# EasyEDA Pro project Armor_ProProject.epro, board PCB9
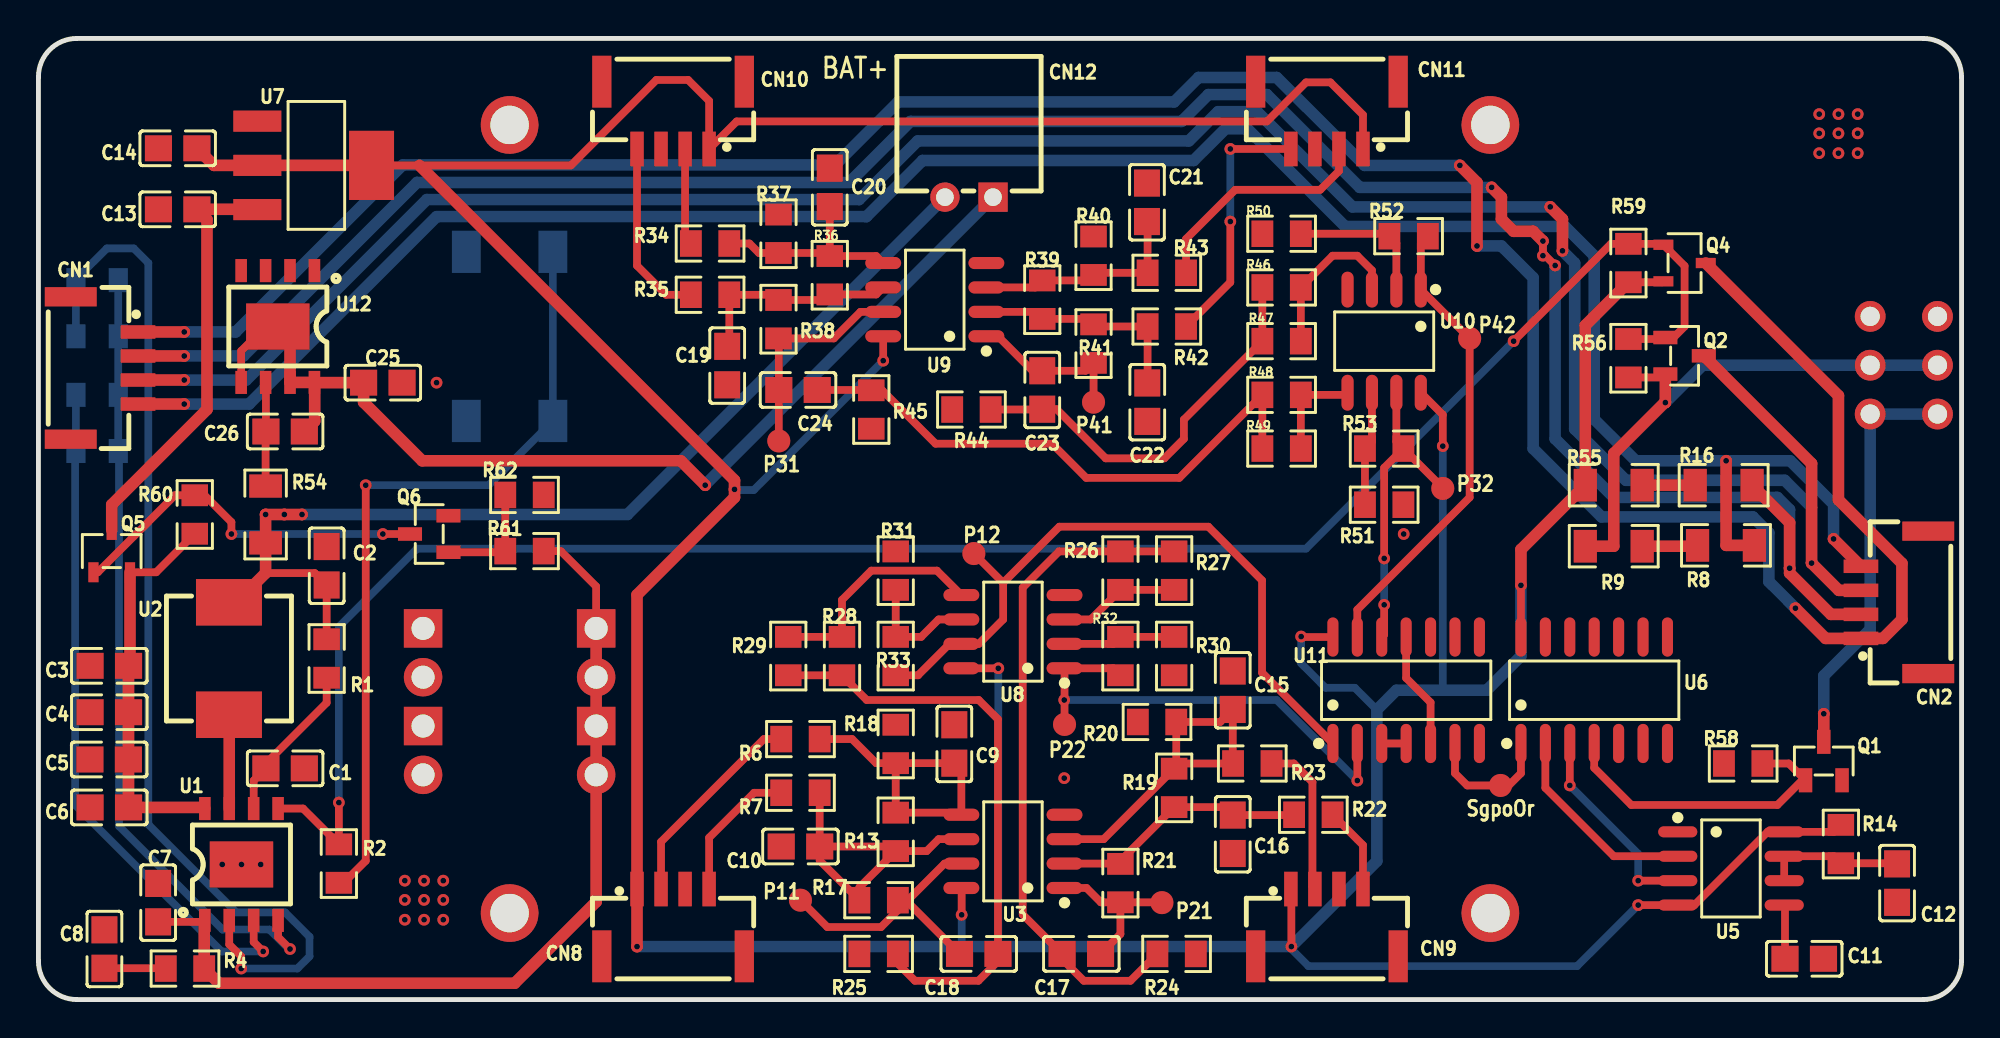
[diagram p10: board, top side]
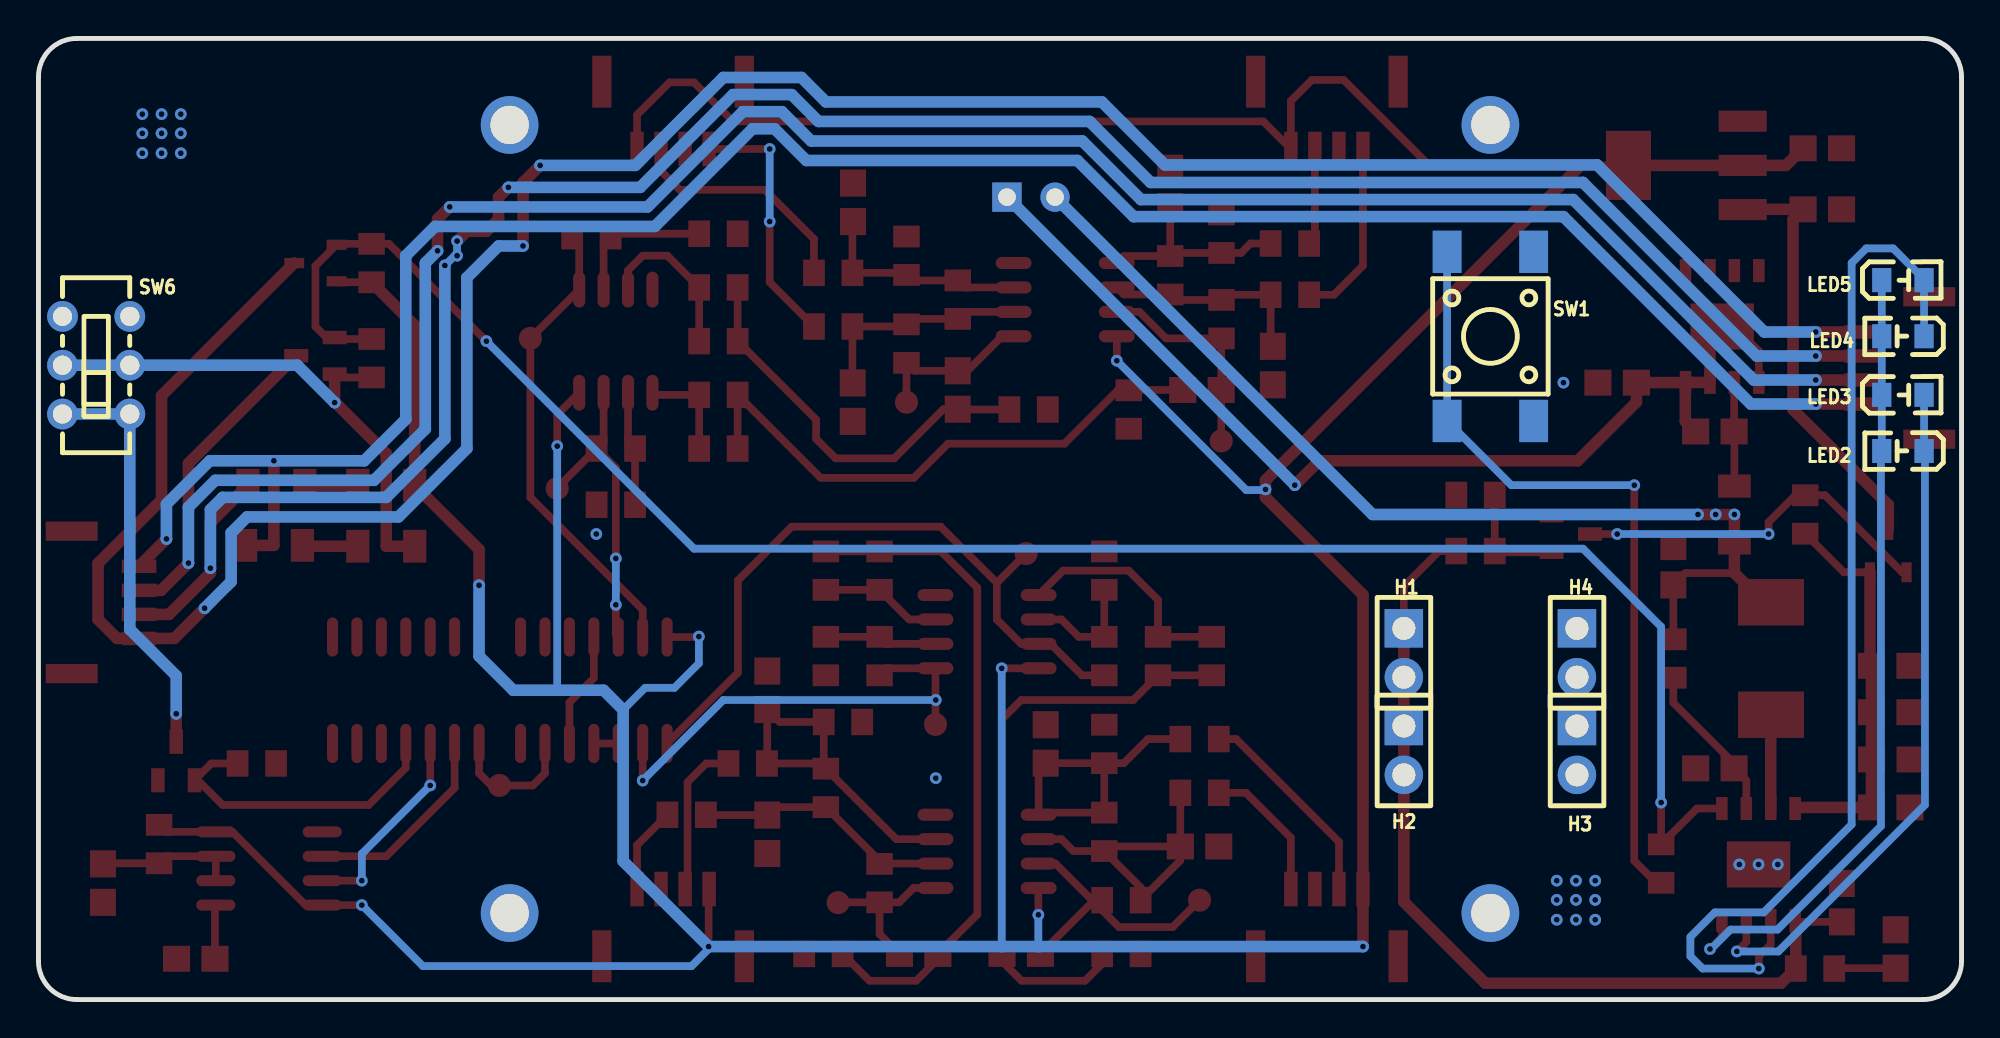
[diagram p11: board, bottom side, seen from below]

Outline 100 x 50 mm; copper layers: Top Layer, Bottom Layer. Coordinates in mm from the lower left corner of the outline.
Outline path: 0,48 0,2 arc(0.59,0.59) 2,0 98,0 arc(99.41,0.59) 100,2 100,48 arc(99.41,49.41) 98,50 2,50 arc(0.59,49.41) 0,48
Stack: Top Layer 0.035mm / Dielectric1 1.51mm FR4 er 4.5 / Bottom Layer 0.035mm

## Design rules (mm)
template: JLCPCB Capability(Two Layers Board)
spacing copperThickness1oz (default): track to track 0.102, other pairs 0.152 to 0.3
spacing copperThickness2oz: track to track 0.203, other pairs 0.152 to 0.3
track width copperThickness1oz (default): min 0.127, default 0.254, max 2.54
track width copperThickness2oz: min 0.203, default 0.254, max 2.54
differential pair differentialPair (default): width min 0.127, default 0.254, max 2.54; gap min 0.152, default 0.152
via viaSize (default): diameter min 0.5, default 0.61, max 10; hole min 0.3, default 0.305, max 6.3

## Placement (name value [footprint] x y rotation side)
C1  22uF  [C0805]  12.83 12.03 180 top
C2  22uF  [C0805]  14.99 22.57 270 top
C3  22uF  [C0805]  3.68 17.36 0 top
C4  22uF  [C0805]  3.68 14.95 0 top
C5  22uF  [C0805]  3.68 12.49 0 top
C6  22uF  [C0805]  3.68 10 0 top
C7  10uF  [C0805]  6.22 5.04 90 top
C8  10uF  [C0805]  3.43 2.63 90 top
C9  100nF  [C0805]  47.62 13.3 270 top
C10  100nF  [C0805]  39.62 7.96 180 top
C11  10nF  [C0805]  91.82 2.12 180 top
C12  10uF  [C0805]  96.65 6.06 90 top
C13  10uF  [C0805]  7.24 41.11 0 top
C14  10uF  [C0805]  7.24 44.28 180 top
C15  100nF  [C0805]  62.1 16.09 270 top
C16  100nF  [C0805]  62.1 8.6 270 top
C17  100uF  [C0805]  54.23 2.38 180 top
C18  100uF  [C0805]  48.9 2.38 0 top
C19  100nF  [C0805]  35.81 32.98 270 top
C20  100nF  [C0805]  41.15 42.25 270 top
C21  100nF  [C0805]  57.64 41.47 270 top
C22  100nF  [C0805]  57.66 31.08 270 top
C23  100uF  [C0805]  52.2 31.71 270 top
C24  100uF  [C0805]  39.5 31.71 0 top
C25  2.2uF  [C0805]  17.91 32.09 0 top
C26  4.7uF  [C0805]  12.83 29.55 180 top
CN1  LED2  [CONN-SMD_4P-P1.27_GH125-S04DCA-00]  3.43 32.86 270 top
CN2  LED1  [CONN-SMD_4P-P1.27_GH125-S04DCA-00]  96.52 20.66 90 top
CN8  应变片1  [CONN-SMD_4P-P1.27_GH125-S04DCA-00]  33 4 0 top
CN9  应变片2  [CONN-SMD_4P-P1.27_GH125-S04DCA-00]  67 4 0 top
CN10  应变片3  [CONN-SMD_4P-P1.27_GH125-S04DCA-00]  33 46 180 top
CN11  应变片4  [CONN-SMD_4P-P1.27_GH125-S04DCA-00]  67 46 180 top
CN12  电池  [CONN-TH_2P-P2.50_HDGC2501WR-2P]  48.39 41.75 180 top
H1  -  [HDR-TH_2P-P2.54-V-F]  29 18.04 270 bottom
H2  -  [HDR-TH_2P-P2.54-V-F]  29 12.96 270 bottom
H3  -  [HDR-TH_2P-P2.54-V-F]  20 12.96 270 bottom
H4  -  [HDR-TH_2P-P2.54-V-F]  20 18.04 270 bottom
LED2  D4  [LED0805-RD]  3.05 28.54 0 bottom
LED3  D3  [LED0805-RD]  3.05 31.46 180 bottom
LED4  D2  [LED0805-RD]  3.05 34.51 0 bottom
LED5  D1  [LED0805-RD]  3.05 37.43 180 bottom
NOREF  -  [Pad_e2305]  53.36 14.31 0 top
NOREF#2  -  [Pad_e258]  75.5 4.5 0 top
NOREF#3  -  [Pad_e2300]  39.62 5.17 0 top
NOREF#4  -  [Pad_e2293]  58.42 5.04 0 top
NOREF#5  -  [Pad_e259]  75.5 45.5 0 top
NOREF#6  -  [Pad_e257]  24.5 4.5 0 top
NOREF#7  -  [Pad_e256]  24.5 45.5 0 top
NOREF#8  -  [Pad_e24]  76.03 11.14 0 top
NOREF#9  -  [Pad_e13]  54.86 31.08 0 top
NOREF#10  -  [Pad_e8]  38.5 29.06 0 top
NOREF#11  -  [Pad_e3]  48.64 23.2 0 top
NOREF#12  -  [Pad_e15]  74.42 34.39 0 top
NOREF#13  -  [Pad_e20]  73.03 26.59 0 top
Q1  NMOS  [SOT-23-3_L2.9-W1.3-P1.90-LS2.4-BR]  92.84 12.41 270 top
Q2  NMOS  [SOT-23-3_L2.9-W1.3-P1.90-LS2.4-BR]  85.6 33.49 180 top
Q4  PMOS  [SOT-23-3_L3.0-W1.7-P0.95-LS2.9-BR]  85.6 38.32 180 top
Q5  PMOS  [SOT-23-3_L3.0-W1.7-P0.95-LS2.9-BR]  3.81 23.33 270 top
Q6  NPN  [SOT-23-3_L2.9-W1.3-P1.90-LS2.4-BR]  20.32 24.22 0 top
R1  500mΩ  [R0805]  14.99 17.74 90 top
R2  10kΩ  [R0805]  15.62 7.07 90 top
R4  2Ω  [R0805]  7.62 1.61 180 top
R6  1kΩ  [R0805]  39.62 13.55 180 top
R7  1kΩ  [R0805]  39.62 10.76 0 top
R8  2Ω  [R1206]  87.75 23.63 0 top
R9  1Ω  [R1206]  81.91 23.58 0 top
R13  10kΩ  [R0805]  44.58 8.72 270 top
R14  5.1kΩ  [R0805]  93.73 8.09 270 top
R16  150mΩ  [R1206]  87.63 26.76 0 top
R17  50kΩ  [R0805]  43.69 5.17 0 top
R18  50kΩ  [R0805]  44.58 13.3 90 top
R19  10kΩ  [R0805]  59.06 11.01 270 top
R20  50kΩ  [R0805]  58.17 14.44 180 top
R21  50kΩ  [R0805]  56.26 6.06 270 top
R22  1kΩ  [R0805]  66.29 9.61 180 top
R23  1kΩ  [R0805]  63.12 12.28 180 top
R24  1kΩ  [R0805]  59.18 2.38 0 top
R25  1kΩ  [R0805]  43.69 2.38 180 top
R26  1kΩ  [R0805]  56.26 22.31 270 top
R27  100kΩ  [R0805]  59.06 22.31 270 top
R28  1kΩ  [R0805]  41.78 17.87 90 top
R29  100kΩ  [R0805]  38.99 17.87 90 top
R30  1kΩ  [R0805]  59.06 17.87 90 top
R31  1kΩ  [R0805]  44.58 22.31 270 top
R32  100kΩ  [R0805]  56.26 17.87 270 top
R33  100kΩ  [R0805]  44.58 17.87 270 top
R34  1kΩ  [R0805]  34.93 39.33 180 top
R35  1kΩ  [R0805]  34.93 36.67 0 top
R36  10kΩ  [R0805]  41.15 37.68 270 top
R37  50kΩ  [R0805]  38.48 39.84 90 top
R38  50kΩ  [R0805]  38.48 35.39 270 top
R39  10kΩ  [R0805]  52.2 36.41 270 top
R40  50kΩ  [R0805]  54.86 38.7 90 top
R41  50kΩ  [R0805]  54.86 34.12 270 top
R42  1kΩ  [R0805]  58.67 35.01 180 top
R43  1kΩ  [R0805]  58.67 37.81 180 top
R44  1kΩ  [R0805]  48.51 30.7 180 top
R45  1kΩ  [R0805]  43.31 30.7 270 top
R46  1kΩ  [R0805]  64.64 37.05 0 top
R47  100kΩ  [R0805]  64.64 34.25 0 top
R48  1kΩ  [R0805]  64.64 31.46 0 top
R49  100kΩ  [R0805]  64.64 28.66 0 top
R50  1kΩ  [R0805]  64.64 39.84 0 top
R51  1kΩ  [R0805]  69.98 25.74 180 top
R52  100kΩ  [R0805]  71.25 39.71 0 top
R53  100kΩ  [R0805]  69.98 28.66 0 top
R54  100Ω  [R1206]  11.81 25.23 270 top
R55  1.5Ω  [R1206]  81.91 26.76 0 top
R56  10kΩ  [R0805]  82.68 33.36 90 top
R58  10kΩ  [R0805]  88.65 12.28 0 top
R59  10kΩ  [R0805]  82.68 38.32 90 top
R60  10kΩ  [R0805]  8.13 25.23 90 top
R61  1kΩ  [R0805]  25.27 23.33 0 top
R62  10kΩ  [R0805]  25.27 26.25 0 top
SW1  KH-6X6X4.3H-STM  [SW-SMD_4P-L6.0-W6.0-P4.50-LS9.0]  24.5 34.5 270 bottom
SW6  Bling SW  [SW-TH_MSS22D18GX]  97 33 270 bottom
U1  充电宝  [ESOP-8_L4.9-W3.9-P1.27-LS6.0-BL-EP]  10.56 7.03 0 top
U2  1uH  [IND-SMD_L6.5-W6.5_IHLP-2525]  9.91 17.74 90 top
U3  LM358  [SOP-8_L4.9-W3.9-P1.27-LS6.0-BL]  50.67 7.71 90 top
U5  小于Vcc/3触发 输出高电平  [SOP-8_L5.0-W4.0-P1.27-LS6.0-BL]  88.01 6.82 270 top
U6  非门  [SOIC-14_L8.7-W3.9-P1.27-LS6.0-BL]  80.9 16.09 0 top
U7  NCP1117ST33T3G  [SOT-223-3_L6.5-W3.4-P2.30-LS7.0-BR]  14.35 43.4 180 top
U8  LM358  [SOP-8_L4.9-W3.9-P1.27-LS6.0-BL]  50.67 19.14 90 top
U9  LM358  [SOP-8_L4.9-W3.9-P1.27-LS6.0-BL]  46.61 36.41 90 top
U10  LM358  [SOP-8_L4.9-W3.9-P1.27-LS6.0-BL]  69.98 34.25 180 top
U11  或门  [SOIC-14_L8.7-W3.9-P1.27-LS6.0-BL]  71.12 16.09 0 top
U12  IP3005A  [ESOP-8_L4.9-W3.9-P1.27-LS6.0-BL-EP]  12.45 35.01 180 top

## Footprints (pads in the part's own frame, mm; a bottom-side part is the same pattern mirrored in y, then rotated)
C0805
  rect 1.41x1.35 smd: 1(-1,0) 2(1,0)
CONN-SMD_4P-P1.27_GH125-S04DCA-00
  rect 0.7x1.8 smd: 1(-1.875,1.75) 2(-0.625,1.75) 3(0.625,1.75) 4(1.875,1.75)
  rect 1x2.7 smd: 5(3.705,-1.75) 6(-3.705,-1.75)
CONN-TH_2P-P2.50_HDGC2501WR-2P
  rect 1.524x1.524 hole 0.914: 1(-1.25,0)
  round 1.524 hole 0.914: 2(1.25,0)
ESOP-8_L4.9-W3.9-P1.27-LS6.0-BL-EP
  rect 0.6x1.2 smd: 1(-1.905,-2.909) 2(-0.635,-2.909) 3(0.635,-2.909) 4(1.905,-2.909) 5(1.905,2.909) 6(0.635,2.909) 7(-0.635,2.909) 8(-1.905,2.909)
  rect 3.3x2.4 smd: 9(0,0)
HDR-TH_2P-P2.54-V-F
  rect 2x2 hole 1.2: 1(-1.27,0)
  round 2 hole 1.2: 2(1.27,0)
IND-SMD_L6.5-W6.5_IHLP-2525
  rect 2.42x3.43 smd: 1(-2.925,0) 2(2.925,0)
LED0805-RD
  rect 1x1.25 smd: 1(-1.1,0) 2(1.1,0)
Pad_e3
  round 1.2 smd: P12(0,0)
Pad_e8
  round 1.2 smd: P31(0,0)
Pad_e13
  round 1.2 smd: P41(0,0)
Pad_e15
  round 1.2 smd: P42(0,0)
Pad_e20
  round 1.2 smd: P32(0,0)
Pad_e24
  round 1.2 smd: SgpoOr(0,0)
Pad_e256
  round 3 hole 2: 1(0,0)
Pad_e257
  round 3 hole 2: 1(0,0)
Pad_e258
  round 3 hole 2: 1(0,0)
Pad_e259
  round 3 hole 2: 1(0,0)
Pad_e2293
  round 1.2 smd: P21(0,0)
Pad_e2300
  round 1.2 smd: P11(0,0)
Pad_e2305
  round 1.2 smd: P22(0,0)
R0805
  rect 1.133x1.377 smd: 1(-1,0) 2(1,0)
R1206
  rect 1.208x1.701 smd: 1(-1.479,0) 2(1.479,0)
SOIC-14_L8.7-W3.9-P1.27-LS6.0-BL
  oval 0.574x2.038 smd: 1(-3.81,-2.769) 2(-2.54,-2.769) 3(-1.27,-2.769) 4(0,-2.769) 5(1.27,-2.769) 6(2.54,-2.769) 7(3.81,-2.769) 8(3.81,2.769) 9(2.54,2.769) 10(1.27,2.769) 11(0,2.769) 12(-1.27,2.769) 13(-2.54,2.769) 14(-3.81,2.769)
SOP-8_L4.9-W3.9-P1.27-LS6.0-BL
  oval 0.63x1.865 smd: 1(-1.905,-2.683) 2(-0.635,-2.683) 3(0.635,-2.683) 4(1.905,-2.683) 5(1.905,2.683) 6(0.635,2.683) 7(-0.635,2.683) 8(-1.905,2.683)
SOP-8_L5.0-W4.0-P1.27-LS6.0-BL
  oval 0.574x2.035 smd: 1(-1.905,-2.768) 2(-0.635,-2.768) 3(0.635,-2.768) 4(1.905,-2.768) 5(1.905,2.768) 6(0.635,2.768) 7(-0.635,2.768) 8(-1.905,2.768)
SOT-23-3_L2.9-W1.3-P1.90-LS2.4-BR
  rect 1.25x0.7 smd: 1(1,-0.95) 2(1,0.95) 3(-1,0)
SOT-23-3_L3.0-W1.7-P0.95-LS2.9-BR
  rect 1.038x0.532 smd: 1(1.101,-0.95) 2(1.101,0.95) 3(-1.101,0)
SOT-223-3_L6.5-W3.4-P2.30-LS7.0-BR
  rect 2.5x1.1 smd: 1(2.97,-2.3) 2(2.97,0) 3(2.97,2.3)
  rect 2.34x3.6 smd: 4(-2.97,0)
SW-SMD_4P-L6.0-W6.0-P4.50-LS9.0
  rect 2.2x1.5 smd: 1(-4.4,2.25) 2(-4.4,-2.25) 3(4.4,2.25) 4(4.4,-2.25)
SW-TH_MSS22D18GX
  round 1.6 hole 1: 1(-2.54,1.75) 2(0,1.75) 3(2.54,1.75) 4(-2.54,-1.75) 5(0,-1.75) 6(2.54,-1.75)

## Nets
As in the schematic, except:
SGPO1: NOREF#11.P12 R33.2 U8.7 U11.1
SGPO2: NOREF.P22 R32.2 U8.1 U11.2
SGPO3: NOREF#13.P32 R53.2 U10.7 U11.12
SGPO4: NOREF#12.P42 R52.2 U10.1 U11.13
SGPO-OR: NOREF#8.SgpoOr U6.1 U11.6
$1N1799: C18.1 NOREF#3.P11 R17.2 U3.7
$1N9328: C17.1 NOREF#4.P21 R21.2 U3.1
$1N12385: C24.1 NOREF#10.P31 R38.2 U9.7
$1N12421: C23.1 NOREF#9.P41 R41.2 U9.1

Pads without a net: CN1 5 6; CN2 5 6; CN8 5 6; CN9 5 6; CN10 5 6; CN11 5 6; NOREF#2 1; NOREF#5 1; NOREF#6 1; NOREF#7 1; U6 5 6 8 9 10 11 12 13; U11 8 9 10; U12 1

## Via types
v1: diameter 0.61, hole 0.305, Top Layer to Bottom Layer, 73 vias

## Routing (per net, layer and track width the routed paths; a pad name or vN(x,y) marks a point on that pad's centre or on a via; arc(x,y) is an arc through that point)
3V3: length 292.7
  Top Layer w0.4: v1(65.15,2.76) 65.15,5.72 CN9.1 ; U7.4 27.69,43.4 32.13,47.84 33.78,47.84 34.88,46.75 CN10.1 36.31,45.68 63.88,45.68 65.91,47.71 67.18,47.71 68.88,46.02 CN11.1 ; v1(83.19,4.92) 86.11,4.92 89.92,8.72 U5.8 93.36,8.72 R14.1 ; U3.8 48.01,5.79 v1(48.01,4.41) ; U9.8 v1(43.93,33.24) ; v1(65.66,18.89) 65.68,18.86 U11.14 ; v1(73.03,28.79) 73.03,30.43 U10.8 ; U8.8 v1(49.91,17.23) ; Q4.2 84.45,37.32 R59.1 ; U6.14 v1(77.09,21.55)
  Top Layer w0.6: R59.1 80.44,35.08 R55.1 77.09,23.41 v1(77.09,21.55) ; U7.4 U7.2 9.13,43.4 C14.1 ; 19.81,43.4 36.19,27.01 v1(36.19,26.54) 36.19,26.12 31.12,21.05 CN8.1 v1(31.12,2.76)
  Bottom Layer w0.4: 49.9,2.76 49.91,2.76 v1(49.91,17.23) ; 69.6,15.08 68.45,16.22 66.93,16.22 65.66,17.49 v1(65.66,18.89) ; 48.01,2.76 v1(48.01,4.41) ; v1(73.03,28.79) 73.03,16.14 72.97,16.09 ; v1(65.15,2.76) 65.15,2.63 66.04,1.74 80.01,1.74 v1(83.19,4.92) ; 36.19,26.5 37.2,26.5 v1(43.93,33.24)
  Bottom Layer w0.6: v1(77.09,21.55) 77.09,17.87 75.31,16.09 70.61,16.09 69.6,15.08 69.6,7.2 v1(65.15,2.76) v1(31.12,2.76)
GND:
  vias: v1(9.56,7.03) v1(10.56,7.03) v1(11.56,7.03) v1(19.05,6.19) v1(19.05,5.19) v1(19.05,4.15) v1(20.05,6.19) v1(20.05,5.19) v1(20.05,4.15) v1(20.7,32.09) v1(21.05,6.19) v1(21.05,5.19) v1(21.05,4.15) v1(53.34,11.52) v1(70.99,24.22) v1(92.6,46.06) v1(92.6,45.06) v1(92.6,44.03) v1(93.6,46.06) v1(93.6,45.06) v1(93.6,44.03) v1(94.6,46.06) v1(94.6,45.06) v1(94.6,44.03)
1GRAY: length 7.4
  Top Layer w0.4: CN8.4 34.88,8.42 37.21,10.76 R7.1
1WHITE: length 10.9
  Top Layer w0.4: CN8.2 32.38,8.21 37.72,13.55 R6.2
555OUT: length 10.7
  Top Layer w0.4: U5.3 v1(83.19,6.19) ; v1(79.63,11.14) U6.3
  Bottom Layer w0.4: v1(83.19,6.19) 83.19,7.58 v1(79.63,11.14)
555OUTNO: length 16.2
  Top Layer w0.4: U6.4 80.9,12.05 82.83,10.12 90.42,10.12 91.71,11.41 Q1.1 91.01,12.28 R58.2
B+: length 121.4
  Top Layer w0.4: v1(78.23,39.46) v1(78.23,38.7) 78.36,38.7 v1(78.87,38.19)
  Top Layer w0.6: R16.2 91.06,24.81 v1(91.06,22.44) 91.06,22.19 93.21,20.04 CN2.2 ; v1(7.58,33.48) CN1.2 ; v1(78.23,39.46) 77.72,39.97 76.71,39.97 76.07,40.6 76.07,41.75 v1(75.56,42.25)
  Bottom Layer w0.4: v1(78.23,39.46) 78.23,38.82 v1(78.87,38.19)
  Bottom Layer w0.6: v1(91.06,22.44) 91.06,25.49 90.42,26.12 81.91,26.12 78.87,29.17 v1(78.87,38.19) ; v1(75.56,42.25) 68.71,42.25 63.88,47.08 60.83,47.08 59.44,45.68 45.34,45.68 42.16,42.51 19.69,42.51 10.66,33.48 v1(7.58,33.48)
B-: length 126.5
  Top Layer w0.6: CN2.3 93.62,21.29 v1(92.2,22.71) 92.2,27.89 Q2.3 ; v1(79.25,38.95) 79.25,40.6 v1(78.61,41.24) ; v1(7.58,32.23) CN1.3
  Bottom Layer w0.6: v1(92.2,22.71) 92.2,25.62 90.81,27.01 82.55,27.01 79.88,29.68 79.88,38.32 v1(79.25,38.95) ; v1(78.61,41.24) 68.33,41.24 63.37,46.19 61.34,46.19 59.82,44.67 45.72,44.67 42.67,41.62 20.19,41.62 10.81,32.23 v1(7.58,32.23)
BAT+: length 54
  Top Layer w0.4: R1.2 C2.2 14.37,22.19 11.81,22.19
  Top Layer w0.6: U2.2 10.29,20.67 11.81,22.19 R54.2 v1(11.81,25.23) v1(12.78,25.23) v1(13.7,25.23)
  Bottom Layer w0.6: CN12.2 30.63,25.23 v1(13.7,25.23)
LED-: length 28.5
  Top Layer w0.4: R56.1 84.42,32.36 Q2.2
  Top Layer w0.6: Q2.2 v1(84.6,31.06) 84.56,31.06 81.91,28.41 81.91,23.58 R9.1
  Bottom Layer w0.6: v1(84.6,31.06) 86.54,33 SW6.2 SW6.5
NMOS-D: length 21.6
  Top Layer w0.6: v1(92.84,14.87) Q1.3
  Bottom Layer w0.6: v1(92.84,14.87) 92.84,16.85 95.25,19.26 SW6.3 SW6.6
PB-KEY: length 100.2
  Top Layer w0.4: Q4.1 85.6,38.16 85.6,35.01 85.02,34.44 Q2.1 84.52,34.36 R56.2 ; U1.5 13.76,9.94 R2.2 v1(15.62,10.25) ; 84.45,39.32 R59.2 81.77,39.32 v1(76.71,34.25)
  Bottom Layer w0.4: v1(76.71,34.25) 65.91,23.46 19.69,23.46 15.62,19.39 v1(15.62,10.25)
POWERBANK5VOUT: length 20.5
  Top Layer w0.4: R60.1 6.12,22.23 Q5.2
  Top Layer w0.6: Q5.2 4.76,17.44 C3.2 C4.2 4.68,12.5 C5.2 4.68,12.48 C6.2 8.59,10 U1.8
R+: length 140.5
  Top Layer w0.6: v1(73.91,43.4) 74.8,42.51 v1(74.8,39.2) ; v1(91.36,20.36) 92.93,18.79 CN2.1 ; 95.37,18.79 95.91,18.79 96.9,19.77 96.9,22.69 93.6,26 93.6,31.42 Q4.3 ; v1(7.58,34.73) CN1.1
  Bottom Layer w0.6: v1(73.91,43.4) 68.96,43.4 64.39,47.97 60.32,47.97 59.06,46.7 44.7,46.7 41.43,43.42 18.95,43.42 10.26,34.73 v1(7.58,34.73) ; v1(91.36,20.36) 89.98,21.74 89.98,24.28 89.15,25.11 81.28,25.11 77.72,28.66 77.72,37.55 76.07,39.2 v1(74.8,39.2)
R-: length 116.9
  Top Layer w0.6: v1(7.58,30.98) CN1.4 ; 87.76,28.03 87.76,23.63 R8.2 ; CN2.4 v1(93.34,23.96)
  Bottom Layer w0.6: v1(93.34,23.96) 93.34,25.78 91.09,28.03 v1(87.76,28.03) 83.06,28.03 80.9,30.19 80.9,38.7 79.38,40.22 67.94,40.22 62.87,45.3 61.72,45.3 60.07,43.65 45.97,43.65 43.05,40.73 20.7,40.73 10.95,30.98 v1(7.58,30.98)
SGPO1: length 36.7
  Top Layer w0.4: 50.16,21.68 53.09,24.6 60.83,24.6 63.63,21.81 63.63,17 U11.1 ; 50.16,21.68 NOREF#11.P12 ; 50.16,21.68 50.16,19.77 48.9,18.5 U8.7 47.37,18.5 45.74,16.87 R33.2
SGPO2: length 24.9
  Top Layer w0.4: NOREF.P22 53.36,15.57 v1(53.34,15.58) 53.36,15.6 U8.1 55.9,17.23 R32.2 ; U11.2 v1(68.58,11.39)
  Bottom Layer w0.4: v1(53.34,15.58) 64.39,15.58 v1(68.58,11.39)
SGPO3: length 16.2
  Top Layer w0.4: U10.7 70.61,29.03 R53.2 ; v1(69.98,22.95) 69.98,27.66 R53.2 ; R53.2 73.01,26.63 73.03,26.63 ; v1(69.98,20.54) 69.98,18.99 U11.12
  Bottom Layer w0.4: v1(69.98,20.54) v1(69.98,22.95)
SGPO4: length 24.5
  Top Layer w0.4: U11.13 68.58,20.28 74.42,26.12 NOREF#12.P42 U10.1 71.88,39.35 R52.2
SGPO-NO: length 10.7
  Top Layer w0.4: U5.2 81.91,7.45 78.36,11.01 U6.2
SGPO-OR: length 7.1
  Top Layer w0.4: U11.6 73.66,11.77 74.29,11.14 76.45,11.14 77.09,11.77 U6.1
TYPEC-IN: length 47.3
  Top Layer w0.4: U1.1 8.57,4.04 C7.1 ; R61.2 27.16,23.33 29,21.49 H1.1
  Top Layer w0.6: 8.62,4.09 R4.1 9.38,0.85 24.77,0.85 29,5.09 H2.2 H2.1 H1.2 H1.1
$1N1164: length 4.9
  Top Layer w0.6: U1.7 9.92,14.8 U2.1
$1N1168: length 8.4
  Top Layer w0.4: R1.1 14.99,15.44 11.83,12.28 C1.2 11.19,11.39 U1.6
$1N1170: length 41.7
  Top Layer w0.4: U1.4 12.46,3.25 v1(13.08,2.63)
  Bottom Layer w0.4: v1(13.08,2.63) 13.02,2.63 12.01,3.64 9.57,3.64 4.19,9.02 4.19,28.49 LED2.2 LED3.1 LED4.2 LED5.1
$1N1171: length 36.1
  Top Layer w0.4: v1(11.68,2.5) 11.19,3 U1.3
  Bottom Layer w0.4: v1(11.68,2.5) 9.53,2.5 1.91,10.12 1.91,28.49 LED2.1 LED3.2
$1N1172: length 55.3
  Top Layer w0.4: U1.2 9.92,2.87 10.54,2.25 v1(10.54,1.61)
  Bottom Layer w0.4: LED4.1 LED5.2 1.95,37.47 3.56,39.08 4.95,39.08 5.72,38.32 5.72,9.11 10.29,4.53 12.83,4.53 14.1,3.26 14.1,2.25 13.46,1.61 v1(10.54,1.61)
$1N1174: length 3.2
  Top Layer w0.4: 3.43,1.63 6.6,1.63 R4.2
$1N1187: length 41.3
  Top Layer w0.4: R2.1 15.88,6.07 17.02,7.22 v1(17.02,26.76)
  Bottom Layer w0.4: SW1.2 SW1.4 23.41,26.76 v1(17.02,26.76)
$1N1798: length 17.5
  Top Layer w0.4: R13.2 46.19,7.72 46.81,8.34 U3.6 ; R13.2 42.69,5.84 R17.1 40.62,7.23 C10.1 ; R13.2 44.34,7.96 C10.1 ; C10.1 R7.2
$1N1799: length 14.6
  Top Layer w0.4: 45.1,5.17 R17.2 44.69,4.64 43.81,3.77 41.02,3.77 NOREF#3.P11 ; 45.1,5.17 45.21,5.17 47.12,7.07 U3.7 ; 45.1,5.17 C18.1
$1N1800: length 16.4
  Top Layer w0.4: R18.1 R13.1 47.88,9.72 U3.5 47.99,11.93 C9.2 R18.1 ; R18.1 43.56,12.3 42.31,13.55 R6.1
$1N3086: length 18.7
  Top Layer w0.4: 59.17,12.12 R20.1 61.45,14.44 C15.2 62.1,12.3 R23.2 59.32,12.28 59.17,12.12 ; 59.17,12.12 R19.1 55.39,8.34 U3.3
$1N3192: length 13.4
  Top Layer w0.4: 56.25,7.07 R21.1 ; 56.25,7.07 U3.2 ; 56.25,7.07 56.25,7.2 R19.2 61.69,10.01 C16.1 65.28,9.6 R22.2
$1N9316: length 8.1
  Top Layer w0.4: R23.1 65.28,12.28 66.25,11.31 66.25,5.88 CN9.2
$1N9324: length 4.5
  Top Layer w0.4: CN9.4 68.88,8.03 R22.1
$1N9328: length 8.1
  Top Layer w0.4: U3.1 54.5,5.8 55.25,5.06 R21.2 ; R21.2 56.26,3.41 C17.1 ; R21.2 58.04,5.06
$1N10758: length 30.9
  Top Layer w0.4: R29.1 R28.1 43.07,15.58 48.9,15.58 49.9,14.58 C18.2 49.9,1.99 48.88,0.98 45.58,0.98 44.69,1.87 R25.1
$1N10764: length 34.8
  Top Layer w0.4: R27.1 R26.1 53.07,23.31 51.18,21.42 51.18,4.42 C17.2 53.23,2.11 54.36,0.98 56.78,0.98 R24.1
$1N10767: length 6.3
  Top Layer w0.4: R27.2 R26.2 54.72,19.77 U8.3
$1N10771: length 12.1
  Top Layer w0.4: U8.5 46.72,22.31 43.31,22.31 41.78,20.79 R28.2 R29.2
$1N10927: length 5.9
  Top Layer w0.4: R30.2 R32.1 55.9,18.5 U8.2
$1N10971: length 6.2
  Top Layer w0.4: R31.2 R33.1 45.9,18.87 46.81,19.77 U8.6
$1N12384: length 11.1
  Top Layer w0.4: U9.6 43.56,36.68 R36.2 40.86,36.39 R38.1 38.21,36.67 R35.2 35.93,34.09 C19.1
$1N12385: length 11.4
  Top Layer w0.4: U9.7 42.74,35.78 41.36,34.39 R38.2 38.5,34.38 C24.1 NOREF#10.P31 38.48,29.05
$1N12386: length 11
  Top Layer w0.4: R36.1 40.99,38.84 R37.1 37.47,38.84 36.97,39.33 R34.1 ; R36.1 43.56,38.68 U9.5 ; R36.1 C20.2
$1N12397: length 11.4
  Top Layer w0.4: C21.2 57.67,40.44 R43.2 54.97,37.81 R40.1 54.58,37.41 R39.1 51.83,37.05 U9.3
$1N12398: length 11.6
  Top Layer w0.4: U9.2 51.83,35.78 R39.2 54.58,35.41 R41.1 54.97,35.01 R42.2 57.67,32.09 C22.1
$1N12405: length 5
  Top Layer w0.4: CN10.2 33.62,39.63 R34.2
$1N12407: length 9.5
  Top Layer w0.4: CN10.4 31.12,38.18 32.64,36.67 R35.1
$1N12415: length 12.3
  Top Layer w0.4: CN11.2 67.62,43.1 66.65,42.13 62.23,42.13 59.67,39.57 R43.1
$1N12417: length 13.3
  Top Layer w0.4: CN11.4 v1(61.98,44.25) ; R42.1 61.98,37.32 v1(61.98,40.47)
  Bottom Layer w0.4: v1(61.98,44.25) v1(61.98,40.47)
$1N12421: length 8.5
  Top Layer w0.4: NOREF#9.P41 R41.2 54.45,32.71 C23.1 51.69,32.71 49.9,34.51 U9.1
$1N12428: length 29.6
  Top Layer w0.4: C24.2 43.29,31.71 R45.1 43.87,31.7 46.65,28.92 52.71,28.92 54.48,27.14 59.32,27.14 R48.1 R49.1
$1N12432: length 21.1
  Top Layer w0.4: R46.1 R47.1 59.56,30.17 59.56,29.17 58.55,28.16 55.5,28.16 52.94,30.71 C23.2 52.18,30.7 R44.1
$1N12436: length 8.5
  Top Layer w0.4: U10.3 69.34,37.94 68.58,38.7 67.29,38.7 R46.2 R47.2
$1N12438: length 5.3
  Top Layer w0.4: U10.5 67.96,31.46 R48.2 R49.2
$1N12448: length 7.6
  Top Layer w0.4: R50.2 70.12,39.84 R52.1 70.61,39.35 U10.2
$1N12454: length 6
  Top Layer w0.4: U10.6 69.34,29.03 R53.1 R51.2
$1N15213: length 1.3
  Top Layer w0.4: U11.3 U11.4
$1N15218: length 6.1
  Top Layer w0.4: U11.11 71.12,16.73 72.39,15.46 U11.5
$1N15499: length 2.8
  Top Layer w0.4: C11.2 90.82,4.87 90.78,4.92
$1N15503: length 7.3
  Top Layer w0.4: C12.2 96.62,7.09 R14.2 93.36,7.45 U5.7 U5.6
$1N18549: length 55.6
  Top Layer w0.4: U12.5 10.54,33.74 11.81,35.01 U12.9 ; 14.36,32.09 U12.8
  Top Layer w0.6: U12.9 13.08,34.38 U12.7 U12.8 ; C26.1 14.36,30.09 14.36,32.09 C25.1 16.91,31.08 19.95,28.03 33.4,28.03 v1(34.67,26.76)
  Bottom Layer w0.6: v1(34.67,26.76) 34.67,26.78 CN12.1
$1N18554: length 5.4
  Top Layer w0.4: R54.1 11.81,29.54 C26.2 11.83,32.09 U12.6
$1N19095: length 2.8
  Top Layer w0.6: 86.15,26.76 R55.2
$1N19096: length 2.9
  Top Layer w0.6: R9.2 86.23,23.58 R8.1
$1N79158: length 19.3
  Top Layer w0.4: v1(10.03,24.22) 10.03,24.84 8.64,26.23 R60.2 7.1,26.23 3.09,22.23 Q5.1 ; v1(17.91,24.22) Q6.3
  Bottom Layer w0.4: v1(10.03,24.22) v1(17.91,24.22)
$1N79160: length 5.8
  Top Layer w0.4: Q6.1 24.21,23.27 R61.1 24.27,26.16
$1N79176: length 22.1
  Top Layer w0.6: U7.3 11.37,41.11 C13.2 8.76,40.59 8.76,30.7 3.81,25.74 Q5.3

## Copper pours and planes (outline as drawn; the poured copper is in the pictures)
3V3 on Top Layer: 12.95,48.98 22.57,48.98 22.57,38.98 12.95,38.98
GND on Top Layer: -15.75,72.86 101.6,72.86 101.6,-0.8 -15.75,-0.8
GND on Bottom Layer: -2.03,53.81 123.19,53.81 123.19,-16.68 -2.03,-16.68

## Text on the board
Top Silkscreen Layer: P31 | P11 | P12 | P22 | P41 | P21 | P32 | SgpoOr | P42 | BAT+
